# EAGLE schematic demeter_v22 (EAGLE 6.2)
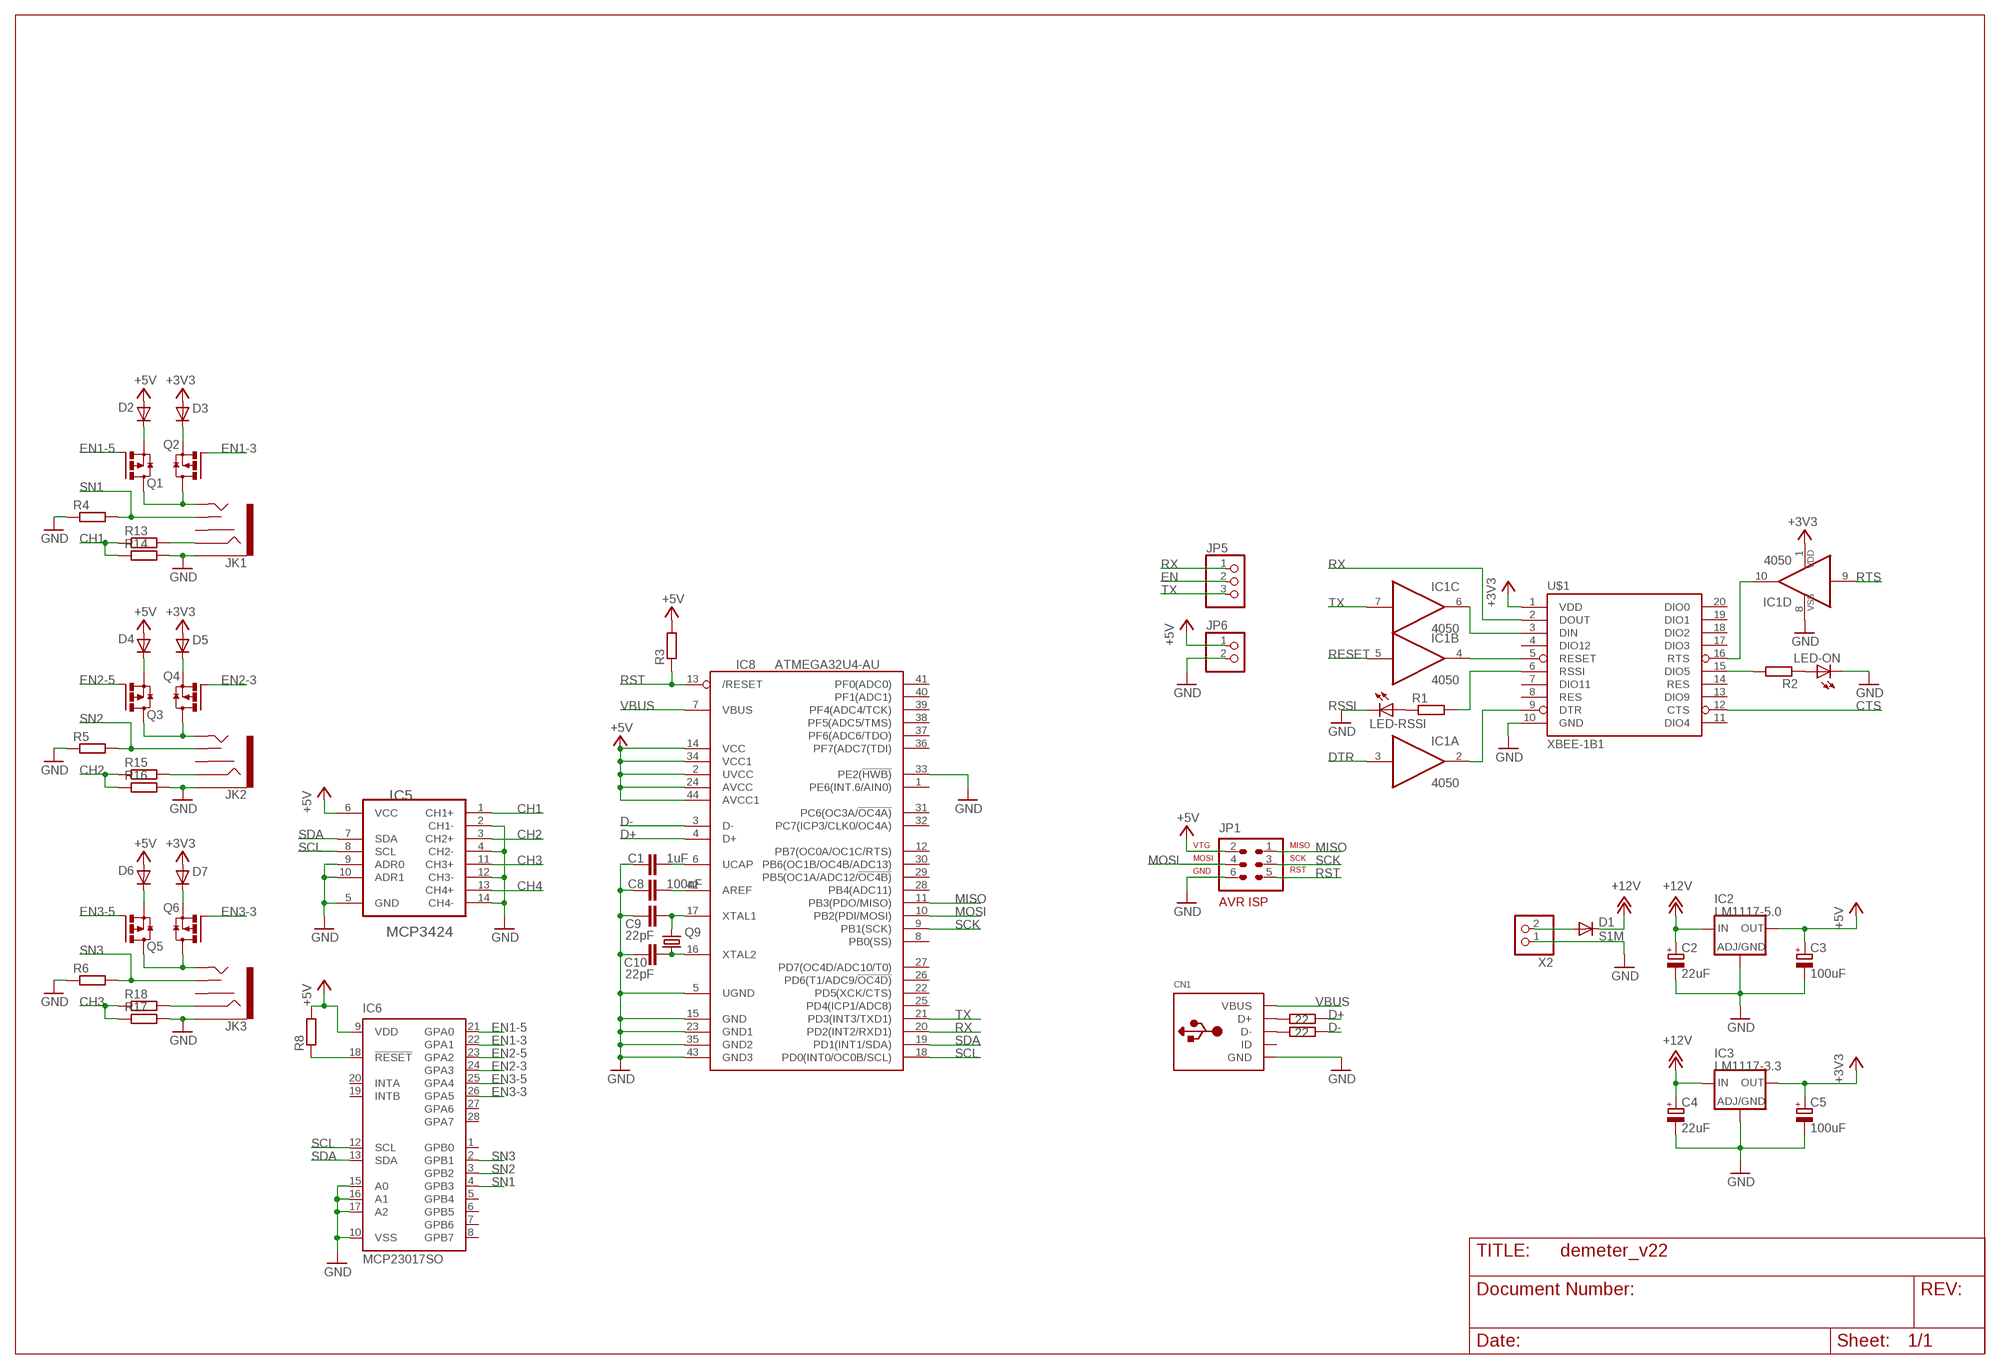
[diagram p0: schematic, sheet 1]

## Parts
C1  1uF  C-EUC0805K  [C0805K]
C2  22uF  CPOL-EUPD  [PANASONIC_D]
C3  100uF  CPOL-EUPD  [PANASONIC_D]
C4  22uF  CPOL-EUPD  [PANASONIC_D]
C5  100uF  CPOL-EUPD  [PANASONIC_D]
C8  100nF  C-EUC0805K  [C0805K]
C9  22pF  C-EUC0805K  [C0805K]
C10  22pF  C-EUC0805K  [C0805K]
CN1  USBMINIB  [USB-MINIB]
D1  S1M  [DO-214AC]
D2  MBR0520  [SOD123]
D3  MBR0520  [SOD123]
D4  MBR0520  [SOD123]
D5  MBR0520  [SOD123]
D6  MBR0520  [SOD123]
D7  MBR0520  [SOD123]
IC1  4050  4050D  [SO16]
IC2  LM1117-5.0  LM1117DT  [DPACK]
IC3  LM1117-3.3  LM1117DT  [DPACK]
IC5  MCP3424  [SO14]
IC6  MCP23017SO  [SO28W]
IC8  ATMEGA32U4-AU  [TQFP44]
JK1  AUDIO-JACK2PTH  [AUDIO-JACK]
JK2  AUDIO-JACK2PTH  [AUDIO-JACK]
JK3  AUDIO-JACK2PTH  [AUDIO-JACK]
JP1  AVR-ISP-6  [AVR-ISP-6]
JP5  PINHD-1X3180  [1X03]
JP6  PINHD-1X2  [1X02]
LED-ON  LED0805  [CHIP-LED0805]
LED-RSSI  LED0805  [CHIP-LED0805]
Q1  IRLML6402  [SOT23]
Q2  IRLML6402  [SOT23]
Q3  IRLML6402  [SOT23]
Q4  IRLML6402  [SOT23]
Q5  IRLML6402  [SOT23]
Q6  IRLML6402  [SOT23]
Q9  CRYSTALHC49UP  [HC49UP]
R1  R-EU_R0805  [R0805]
R2  R-EU_R0805  [R0805]
R3  R-EU_R0805  [R0805]
R4  R-EU_R0805  [R0805]
R5  R-EU_R0805  [R0805]
R6  R-EU_R0805  [R0805]
R8  R-EU_R0805  [R0805]
R9  22  R-EU_R0805  [R0805]
R10  22  R-EU_R0805  [R0805]
R13  R-EU_R0805  [R0805]
R14  R-EU_R0805  [R0805]
R15  R-EU_R0805  [R0805]
R16  R-EU_R0805  [R0805]
R17  R-EU_R0805  [R0805]
R18  R-EU_R0805  [R0805]
U$1  XBEE-1B1  [XBEE-1]
X2  W237-102  [W237-102]

## Nets
+3V3: C5.+ D3.A D5.A D7.A IC1.1(P:VDD) IC3.4(OUT) U$1.1(VDD)
+5V: C3.+ D2.A D4.A D6.A IC2.4(OUT) IC5.6(VCC) IC6.9(VDD) IC8.2(UVCC) IC8.14(VCC) IC8.24(AVCC) IC8.34(VCC1) IC8.44(AVCC1) JP1.2(VTG) JP6.1 R3.2 R8.2
+12V: C2.+ C4.+ D1.C IC2.3(IN) IC3.3(IN)
CH1: IC5.1(CH1+) R13.1 R14.1
CH2: IC5.3(CH2+) R15.1 R16.1
CH3: IC5.11(CH3+) R17.1 R18.1
CH4: IC5.13(CH4+)
CTS: U$1.12(CTS)
D+: IC8.4(D+) R9.1
D-: IC8.3(D-) R10.1
DTR: IC1.3(A:I)
EN: JP5.2
EN1-3: IC6.22(GPA1) Q2.1(G)
EN1-5: IC6.21(GPA0) Q1.1(G)
EN2-3: IC6.24(GPA3) Q4.1(G)
EN2-5: IC6.23(GPA2) Q3.1(G)
EN3-3: IC6.26(GPA5) Q6.1(G)
EN3-5: IC6.25(GPA4) Q5.1(G)
GND: C1.2 C2.- C3.- C4.- C5.- C8.2 C9.2 C10.2 CN1.GND IC1.8(P:VSS) IC2.1(ADJ) IC3.1(ADJ) IC5.2(CH1-) IC5.4(CH2-) IC5.5(GND) IC5.9(ADR0) IC5.10(ADR1) IC5.12(CH3-) IC5.14(CH4-) IC6.10(VSS) IC6.15(A0) IC6.16(A1) IC6.17(A2) IC8.5(UGND) IC8.15(GND) IC8.23(GND1) IC8.33(PE2(!HWB)) IC8.35(GND2) IC8.43(GND3) JK1.SLEEVE JK2.SLEEVE JK3.SLEEVE JP1.6(GND) JP6.2 LED-ON.C LED-RSSI.C R4.1 R5.1 R6.1 R14.2 R16.2 R17.2 U$1.10(GND) X2.1
MISO: IC8.11(PB3(PDO/MISO)) JP1.1(MISO)
MOSI: IC8.10(PB2(PDI/MOSI)) JP1.4(MOSI)
N$1: D1.A X2.2
N$3: IC1.6(C:O) U$1.3(DIN)
N$4: IC1.4(B:O) U$1.5(RESET)
N$6: LED-RSSI.A R1.1
N$7: IC1.2(A:O) U$1.9(DTR)
N$8: IC1.10(D:O) U$1.16(RTS)
N$9: LED-ON.A R2.1
N$10: R2.2 U$1.15(DIO5)
N$11: IC6.18(!RESET) R8.1
N$12: JK1.TIP Q1.3(D) Q2.3(D)
N$13: D2.C Q1.2(S)
N$14: D3.C Q2.2(S)
N$15: JK2.TIP Q3.3(D) Q4.3(D)
N$16: D4.C Q3.2(S)
N$17: D5.C Q4.2(S)
N$18: JK3.TIP Q5.3(D) Q6.3(D)
N$19: D6.C Q5.2(S)
N$20: D7.C Q6.2(S)
N$24: C1.1 IC8.6(UCAP)
N$25: C8.1 IC8.42(AREF)
N$26: C9.1 IC8.17(XTAL1) Q9.2
N$27: C10.1 IC8.16(XTAL2) Q9.1
N$28: CN1.D+ R9.2
N$29: CN1.D- R10.2
N$30: JK1.RING R13.2
N$32: JK2.RING R15.2
N$34: JK3.RING R18.2
RESET: IC1.5(B:I)
RSSI: R1.2 U$1.6(RSSI)
RST: IC8.13(/RESET) JP1.5(RST) R3.1
RTS: IC1.9(D:I)
RX: IC8.20(PD2(INT2/RXD1)) JP5.1 U$1.2(DOUT)
SCK: IC8.9(PB1(SCK)) JP1.3(SCK)
SCL: IC5.8(SCL) IC6.12(SCL) IC8.18(PD0(INT0/OC0B/SCL))
SDA: IC5.7(SDA) IC6.13(SDA) IC8.19(PD1(INT1/SDA))
SN1: IC6.4(GPB3) JK1.TSH R4.2
SN2: IC6.3(GPB2) JK2.TSH R5.2
SN3: IC6.2(GPB1) JK3.TSH R6.2
TX: IC1.7(C:I) IC8.21(PD3(INT3/TXD1)) JP5.3
VBUS: CN1.VBUS IC8.7(VBUS)
Unconnected: CN1.ID IC1.11(E:I) IC1.12(E:O) IC1.14(F:I) IC1.15(F:O) IC6.1(GPB0) IC6.5(GPB4) IC6.6(GPB5) IC6.7(GPB6) IC6.8(GPB7) IC6.19(INTB) IC6.20(INTA) IC6.27(GPA6) IC6.28(GPA7) IC8.1(PE6(INT.6/AIN0)) IC8.8(PB0(SS)) IC8.12(PB7(OC0A/OC1C/RTS)) IC8.22(PD5(XCK/CTS)) IC8.25(PD4(ICP1/ADC8)) IC8.26(PD6(T1/ADC9/!OC4D)) IC8.27(PD7(OC4D/ADC10/T0)) IC8.28(PB4(ADC11)) IC8.29(PB5(OC1A/ADC12/!OC4B)) IC8.30(PB6(OC1B/OC4B/ADC13)) IC8.31(PC6(OC3A/!OC4A)) IC8.32(PC7(ICP3/CLK0/OC4A)) IC8.36(PF7(ADC7(TDI)) IC8.37(PF6(ADC6/TDO)) IC8.38(PF5(ADC5/TMS)) IC8.39(PF4(ADC4/TCK)) IC8.40(PF1(ADC1)) IC8.41(PF0(ADC0)) JK1.RSH JK2.RSH JK3.RSH U$1.4(DIO12) U$1.7(DIO11) U$1.8(RES) U$1.11(DIO4) U$1.13(DIO9) U$1.14(RES) U$1.17(DIO3) U$1.18(DIO2) U$1.19(DIO1) U$1.20(DIO0)

## Library data of the parts
C1 C8-C10 = mark_2:C-EU: CAPACITOR, European symbol
C2-C5 = mark_2:CPOL-EU: POLARIZED CAPACITOR, European symbol
CN1 = mark_2:USB: USB Connectors USBMINIB - Surface Mount Female Mini-B USB Connector 4UConnector: 06564 By microbuilder.eu Thru-hole RA Female Mini-B USB Connector 4UConnector: 18732 By ladyada.net
D1 = mark_2:S1M
D2-D7 = mark_2:MBR0520: SCHOTTKY BARRIER RECTIFIER Source: http://onsemi.com .. MBR0520LT1-D.pdf
IC1 = mark_2:4050: Hex non-inverting BUFFER
IC2 IC3 = mark_2:LM1117: Low drop fixed and adjustable positive voltage regulators 1 A Source: http://www.st.com/stonline/products/literature/ds/7194/ld1117axx.pdf
IC5 = mark_2:MCP3424: Analog-to-Digital Converter; MPN: MCP3424-E/SL; OC_FARNELL: 1630424; OC_NEWARK: 54M4871; PACKAGE: SOIC-14; SUPPLIER: Microchip
IC6 = mark_2:MCP23017: http://ww1.microchip.com/downloads/en/DeviceDoc/21952a.pdf Source: http://ww1.microchip.com/downloads/en/DeviceDoc/21952a.pdf; MF: MICROCHIP; MPN: MCP23017-E/SO; OC_FARNELL: 1332087; OC_NEWARK: 31K2958
IC8 = mark_2:ATMEGA32U4: http://www.ladyada.net/library/eagle
JK1-JK3 = mark_2:AUDIO-JACK2
JP1 = mark_2:AVR-ISP-6: AVR ISP-6 Serial Programming Header
JP5 = mark_2:PINHD-1X3: PIN HEADER
JP6 = mark_2:PINHD-1X2: PIN HEADER
LED-ON LED-RSSI = mark_2:LED
Q1-Q6 = mark_2:IRLML6402: Single P-Channe MOSFET
Q9 = mark_2:CRYSTAL: CRYSTAL
R1-R6 R8-R10 R13-R18 = mark_2:R-EU_: RESISTOR, European symbol
U$1 = mark_2:XBEE-1
X2 = mark_2:W237-102: WAGO SCREW CLAMP